# Altium schematic sheet OutputBuffer.SchDoc
size A4; SheetNumber: 5; SheetTotal: 5
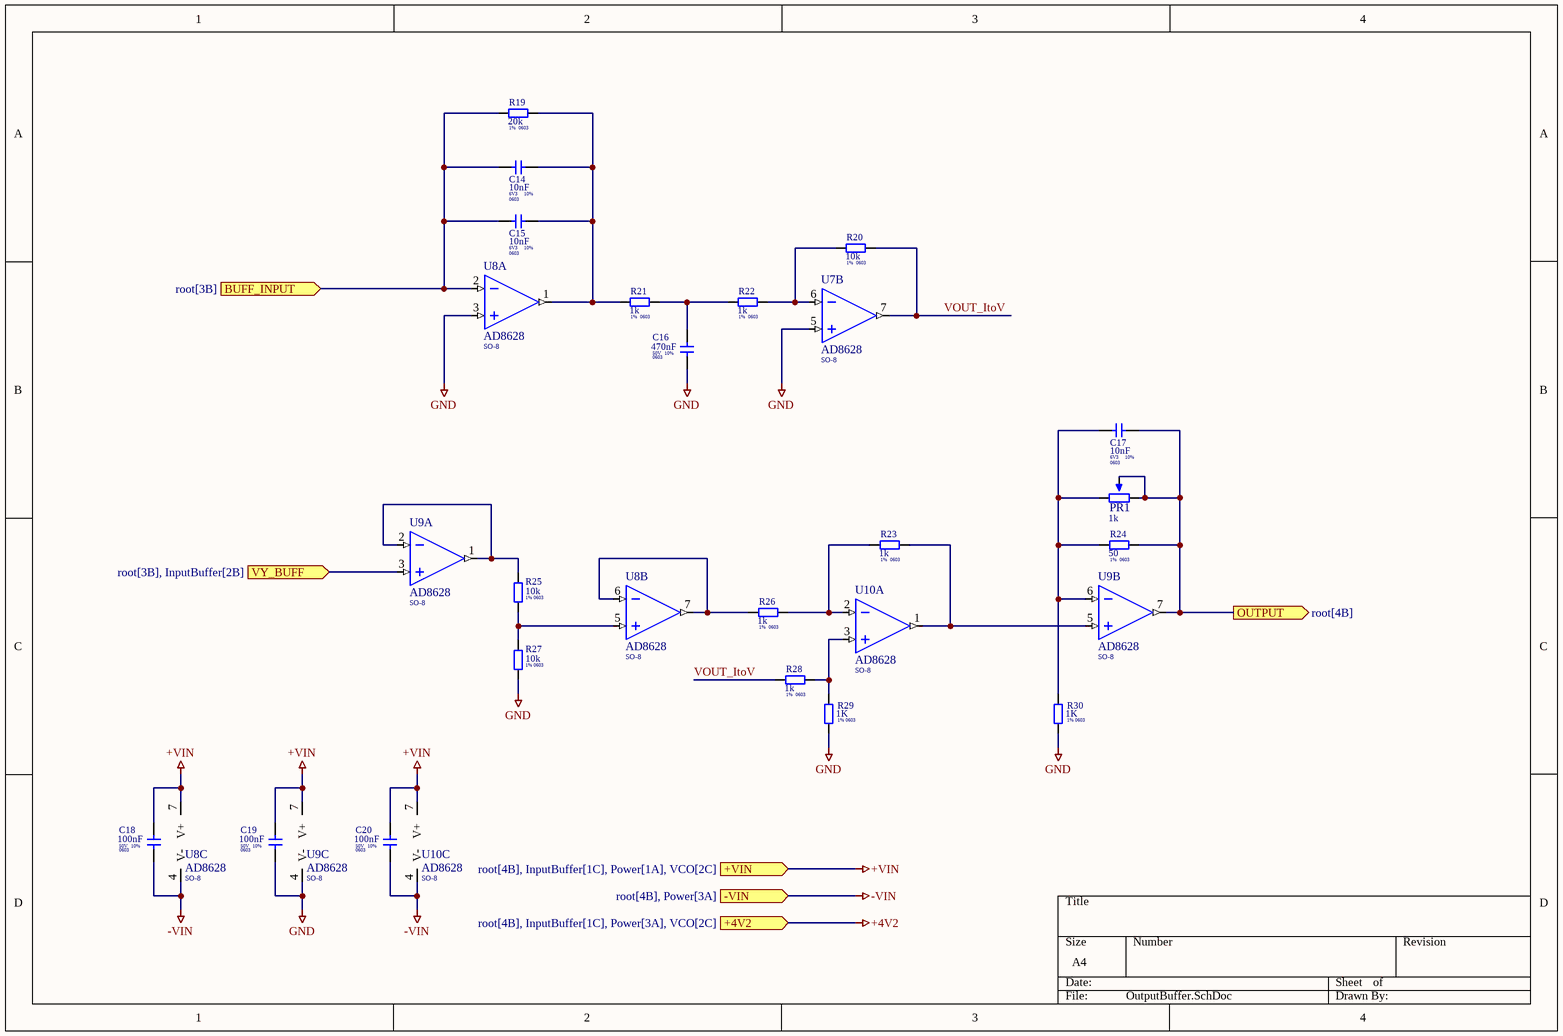
[diagram p0: OutputBuffer.SchDoc]

## Parts
C14  value 10nF  Voltage: 6V3  Tolerant: 10%  Package: 0603  [CAPC1608X06M]  (hidden comment: 10nF/6V3)
C15  value 10nF  Voltage: 6V3  Tolerant: 10%  Package: 0603  [CAPC1608X06M]  (hidden comment: 10nF/6V3)
C16  value 470nF  Voltage: 50V  Tolerant: 10%  Package: 0603  [CAPC1608X06M]  (hidden comment: 470nF/50V)
C17  value 10nF  Voltage: 6V3  Tolerant: 10%  Package: 0603  [CAPC1608X06M]  (hidden comment: 10nF/6V3)
C18  value 100nF  Voltage: 50V  Tolerant: 10%  Package: 0603  [CAPC1608X06M]  (hidden comment: 100nF/50V)
C19  value 100nF  Voltage: 50V  Tolerant: 10%  Package: 0603  [CAPC1608X06M]  (hidden comment: 100nF/50V)
C20  value 100nF  Voltage: 50V  Tolerant: 10%  Package: 0603  [CAPC1608X06M]  (hidden comment: 100nF/50V)
PR1  1k  [PR_TRIM]
R19  value 20k  Package: 0603  Tolerance: 1%  [RESC1608X06L]  (hidden comment: 20k 1%)
R20  value 10k  Package: 0603  Tolerance: 1%  [RESC1608X06L]  (hidden comment: 10k 1%)
R21  value 1k  Package: 0603  Tolerance: 1%  [RESC1608X06L]  (hidden comment: 1k 1%)
R22  value 1k  Package: 0603  Tolerance: 1%  [RESC1608X06L]  (hidden comment: 1k 1%)
R23  value 1k  Package: 0603  Tolerance: 1%  [RESC1608X06L]  (hidden comment: 1k 1%)
R24  value 50  Package: 0603  Tolerance: 1%  [RESC1608X06L]  (hidden comment: 50 1%)
R25  value 10k  Package: 0603  Tolerance: 1%  [RESC1608X06L]  (hidden comment: 10k 1%)
R26  value 1k  Package: 0603  Tolerance: 1%  [RESC1608X06L]  (hidden comment: 1k 1%)
R27  value 10k  Package: 0603  Tolerance: 1%  [RESC1608X06L]  (hidden comment: 10k 1%)
R28  value 1k  Package: 0603  Tolerance: 1%  [RESC1608X06L]  (hidden comment: 1k 1%)
R29  value 1K  Package: 0603  Tolerance: 1%  [RESC1608X06L]  (hidden comment: 1K 1%)
R30  value 1K  Package: 0603  Tolerance: 1%  [RESC1608X06L]  (hidden comment: 1K 1%)
U7  Package: SO-8  [SOIC127P600X170-8N]  (hidden comment: AD8628)  (part B of 3)
U8  Package: SO-8  [SOIC127P600X170-8N]  (hidden comment: AD8628)  (parts A,B,C of 3)
U9  Package: SO-8  [SOIC127P600X170-8N]  (hidden comment: AD8628)  (parts A,B,C of 3)
U10  Package: SO-8  [SOIC127P600X170-8N]  (hidden comment: AD8628)  (parts A,C of 3)

## Ports
+4V2 (in, see root[4B], InputBuffer[1C], Power[3A], VCO[2C]), +VIN (in, see root[4B], InputBuffer[1C], Power[1A], VCO[2C]), -VIN (in, see root[4B], Power[3A]), BUFF_INPUT (in, see root[3B]), OUTPUT (out, see root[4B]), VY_BUFF (in, see root[3B], InputBuffer[2B])

## Nets
+4V2: port +4V2
+VIN: C18.2 C19.2 C20.2 U8.7(V+) U9.7(V+) U10.7(V+) ; port +VIN
-VIN: C18.1 C20.1 U8.4(V-) U10.4(V-) ; port -VIN
GND: C16.1 C19.1 R27.1 R29.1 R30.1 U7.5(IN+) U8.3(IN+) U9.4(V-)
BUFF_INPUT: C14.1 C15.1 R19.1 U8.2(IN-) ; port BUFF_INPUT
OUTPUT: C17.2 PR1.2 PR1.3 R24.2 U9.7(OUT) ; port OUTPUT
VOUT_ItoV: R20.2 R28.1 U7.7(OUT)
VY_BUFF: U9.3(IN+) ; port VY_BUFF
NetC14_2: C14.2 C15.2 R19.2 R21.1 U8.1(OUT)
NetC16_2: C16.2 R21.2 R22.1
NetC17_1: C17.1 PR1.1 R24.1 R30.2 U9.6(IN-)
NetR20_1: R20.1 R22.2 U7.6(IN-)
NetR23_1: R23.1 R26.2 U10.2(IN-)
NetR23_2: R23.2 U9.5(IN+) U10.1(OUT)
NetR25_1: R25.1 R27.2 U8.5(IN+)
NetR25_2: R25.2 U9.1(OUT) U9.2(IN-)
NetR26_1: R26.1 U8.6(IN-) U8.7(OUT)
NetR28_2: R28.2 R29.2 U10.3(IN+)

## Library data of the parts
C14-C20 = C
PR1 = R_PR: VALUE: 1k
R19-R30 = R
U7-U10 = AD8628ARZ: Zero-Drift, Single-Supply, Rail-to-Rail Input/Output Operational Amplifier; Manufacture: Analog; helpurl: https://www.analog.com/media/en/technical-documentation/data-sheets/ad8628-8629-8630.pdf; value: AD8628